# Altium project Buffer.PrjPCB
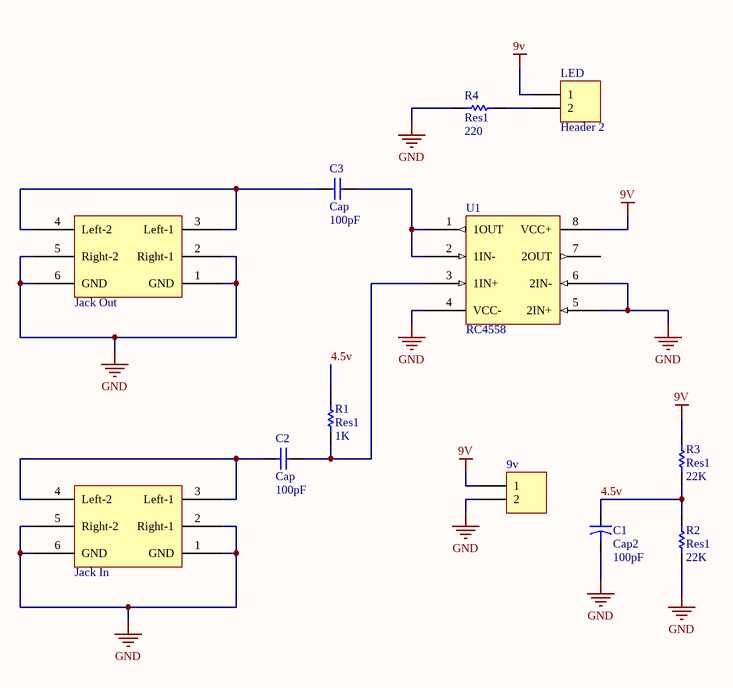
[diagram p0: Buffer.SchDoc]
1 sheet, 12 parts. Net scope: global (net labels, ports and power ports of the same name join across sheets).
Board file: Buffer.PcbDoc

## Sheet Buffer.SchDoc
size A

### Parts
9v  Header 2  [HDR1X2]  (value not drawn)
C1  Cap2  value 100pF  [CAPR5-4X5]
C2  Cap  value 100pF  [RAD-0.3]
C3  Cap  value 100pF  [RAD-0.3]
Jack_In  Jack P10 Stereo Board  [J10]  (value not drawn)
Jack_Out  Jack P10 Stereo Board  [J10]  (value not drawn)
LED  Header 2  [HDR1X2]
R1  Res1  value 1K  [AXIAL-0.3]
R2  Res1  value 22K  [AXIAL-0.3]
R3  Res1  value 22K  [AXIAL-0.3]
R4  Res1  value 220  [AXIAL-0.3]
U1  RC4558  [RC4558DIP8]

### Nets
9V: 9v.1 LED.1 R3.2 U1.8(VCC+)
GND: 9v.2 C1.2 Jack_In.1(GND) Jack_In.2(Right-1) Jack_In.5(Right-2) Jack_In.6(GND) Jack_Out.1(GND) Jack_Out.2(Right-1) Jack_Out.5(Right-2) Jack_Out.6(GND) R2.1 R4.2 U1.4(VCC-) U1.5(2IN+) U1.6(2IN-)
4.5v: C1.1 R1.2 R2.2 R3.1
NetC2_1: C2.1 Jack_In.3(Left-1) Jack_In.4(Left-2)
NetC2_2: C2.2 R1.1 U1.3(1IN+)
NetC3_1: C3.1 Jack_Out.3(Left-1) Jack_Out.4(Left-2)
NetC3_2: C3.2 U1.1(1OUT) U1.2(1IN-)
NetLED_2: LED.2 R4.1

Not connected (* = marked no-connect by the designer): U1 7(2OUT)

### Library data of the parts
9v LED = Header 2: Header, 2-Pin; LatestRevisionDate: 17-Jul-2002; LatestRevisionNote: Re-released for DXP Platform.; Publisher: Altium Limited
C1 = Cap2: Capacitor; Published: 23-Sep-2002; PackageReference: CAPR5-4X5; Publisher: Altium Limited; PackageDescription: Capacitor; 2 Leads
C2 C3 = Cap: Capacitor; Published: 8-Jun-2000; LatestRevisionDate: 17-Jul-2002; LatestRevisionNote: Re-released for DXP Platform.; PackageReference: RAD-0.3; Publisher: Altium Limited; PackageDescription: Radial Cap, Thru-Hole; 2 Leads; 0.3 in Pin Spacing
R1-R4 = Res1: Resistor; Published: 8-Jun-2000; LatestRevisionDate: 17-Jul-2002; LatestRevisionNote: Re-released for DXP Platform.; PackageReference: AXIAL-0.3; Publisher: Altium Limited; PackageDescription: Axial Device, Thru-Hole; 2 Leads; 0.3 in Pin Spacing